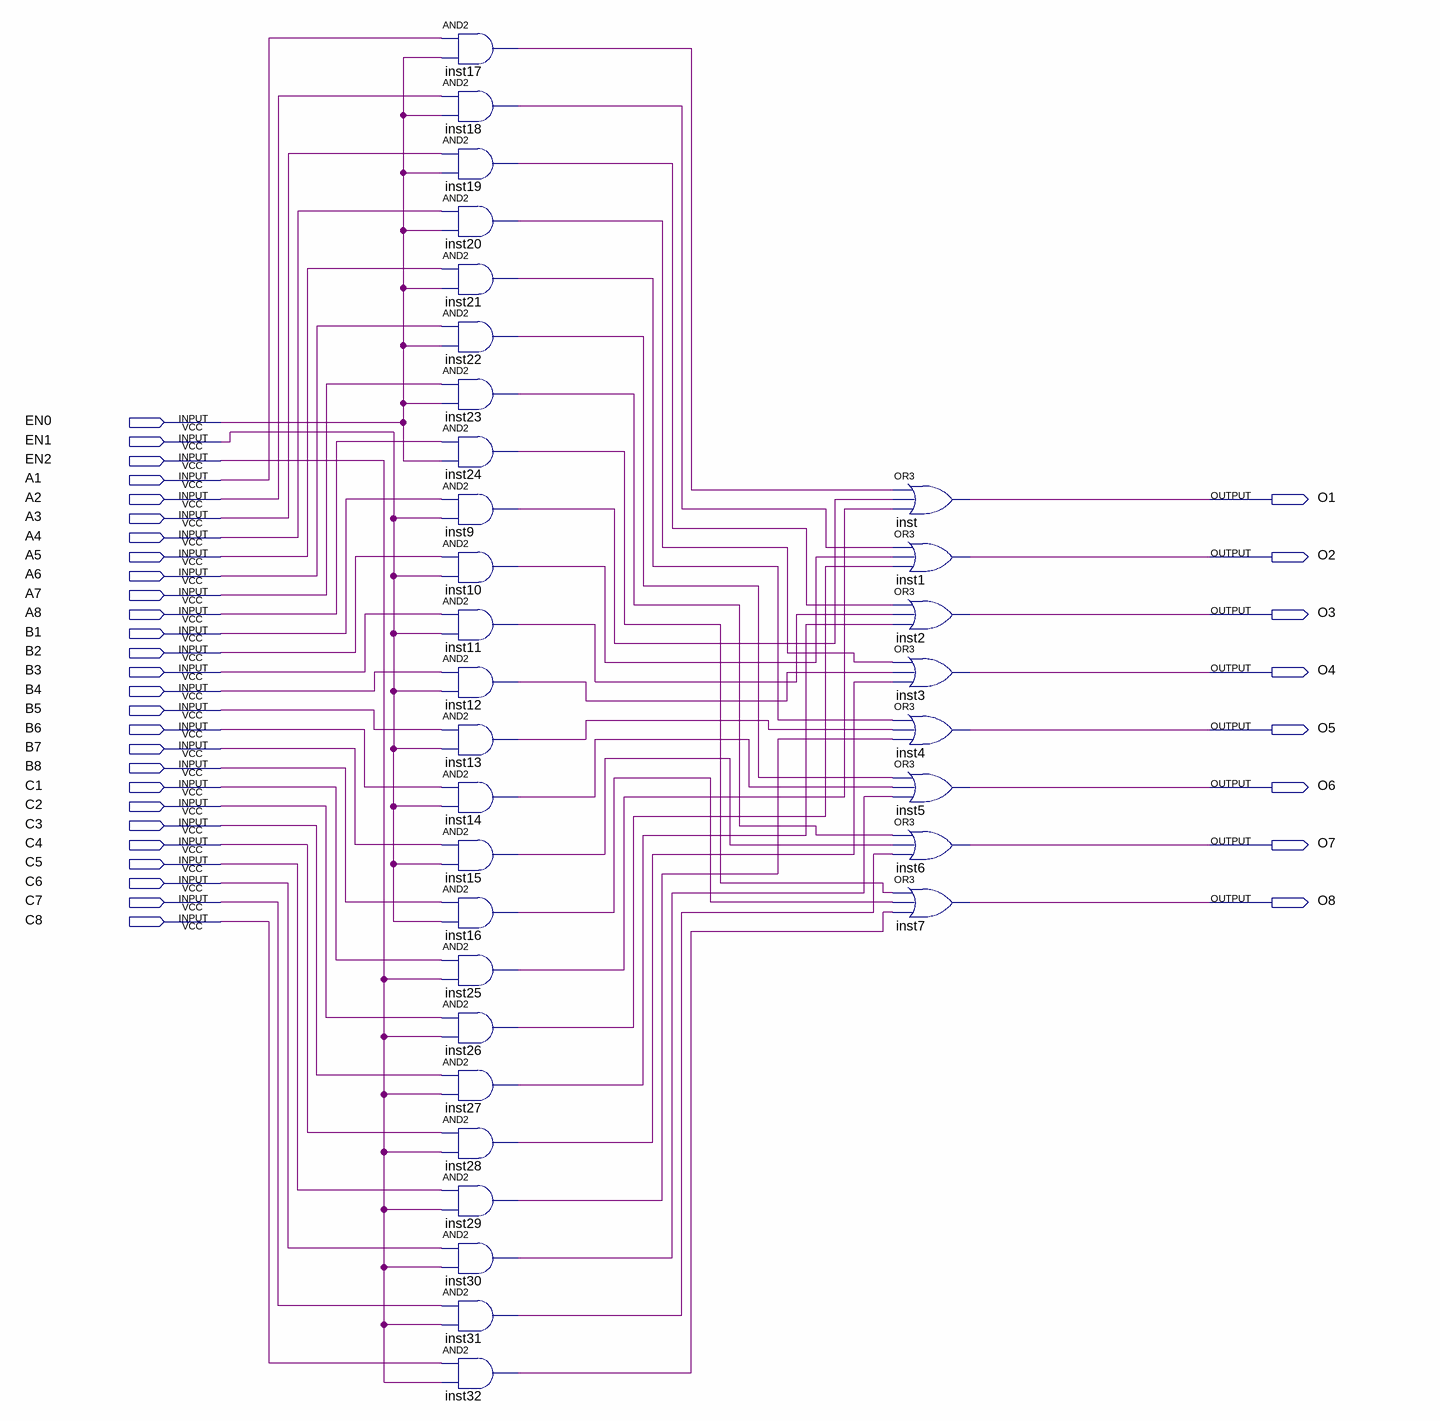
[diagram p0: schematic sheet]
// Quartus schematic 3C1.bdf as structural Verilog: 32 symbols, 35 pins
module \3C1  (
  input  EN0,
  input  EN1,
  input  EN2,
  input  A1,
  input  A2,
  input  A3,
  input  A4,
  input  A5,
  input  A6,
  input  A7,
  input  A8,
  input  B1,
  input  B2,
  input  B3,
  input  B4,
  input  B5,
  input  B6,
  input  B7,
  input  B8,
  input  C1,
  input  C2,
  input  C3,
  input  C4,
  input  C5,
  input  C6,
  input  C7,
  input  C8,
  output O1,
  output O2,
  output O3,
  output O4,
  output O5,
  output O6,
  output O7,
  output O8
);

  wire inst9_out, inst10_out, inst11_out, inst12_out, inst13_out, inst14_out, inst15_out, inst16_out,
       inst17_out, inst18_out, inst19_out, inst20_out, inst21_out, inst22_out, inst23_out, inst24_out,
       inst25_out, inst26_out, inst27_out, inst28_out, inst29_out, inst30_out, inst31_out, inst32_out;

  and inst17 (inst17_out, A1, EN0);
  and inst18 (inst18_out, A2, EN0);
  and inst19 (inst19_out, A3, EN0);
  and inst20 (inst20_out, A4, EN0);
  and inst21 (inst21_out, A5, EN0);
  and inst22 (inst22_out, A6, EN0);
  and inst23 (inst23_out, A7, EN0);
  and inst24 (inst24_out, A8, EN0);
  and inst9 (inst9_out, B1, EN1);
  and inst10 (inst10_out, B2, EN1);
  and inst11 (inst11_out, B3, EN1);
  and inst12 (inst12_out, B4, EN1);
  and inst13 (inst13_out, B5, EN1);
  and inst14 (inst14_out, B6, EN1);
  and inst15 (inst15_out, B7, EN1);
  and inst16 (inst16_out, B8, EN1);
  and inst25 (inst25_out, C1, EN2);
  and inst26 (inst26_out, C2, EN2);
  and inst27 (inst27_out, C3, EN2);
  and inst28 (inst28_out, C4, EN2);
  and inst29 (inst29_out, C5, EN2);
  and inst30 (inst30_out, C6, EN2);
  and inst31 (inst31_out, C7, EN2);
  and inst32 (inst32_out, C8, EN2);
  or inst (O1, inst17_out, inst9_out, inst25_out);
  or inst1 (O2, inst18_out, inst10_out, inst26_out);
  or inst2 (O3, inst19_out, inst11_out, inst27_out);
  or inst3 (O4, inst20_out, inst12_out, inst28_out);
  or inst4 (O5, inst21_out, inst13_out, inst29_out);
  or inst5 (O6, inst22_out, inst14_out, inst30_out);
  or inst6 (O7, inst23_out, inst15_out, inst31_out);
  or inst7 (O8, inst24_out, inst16_out, inst32_out);
endmodule
